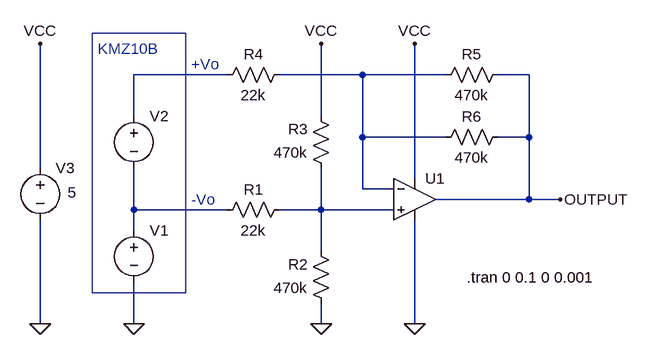
[diagram p0: schematic fieldsensoramp.asc]
fieldsensoramp.asc, the LTspice schematic file:
Version 4
SHEET 1 880 680
WIRE 80 -16 -64 -16
WIRE 288 -16 160 -16
WIRE 416 -16 288 -16
WIRE 544 -16 496 -16
WIRE -64 48 -64 -16
WIRE 224 48 224 -64
WIRE 288 80 288 -16
WIRE 416 80 288 80
WIRE 544 80 544 -16
WIRE 544 80 496 80
WIRE -208 128 -208 -64
WIRE 368 144 368 -64
WIRE 288 160 288 80
WIRE 336 160 288 160
WIRE 544 176 544 80
WIRE 544 176 400 176
WIRE 592 176 544 176
WIRE -64 192 -64 128
WIRE 80 192 -64 192
WIRE 224 192 224 128
WIRE 224 192 160 192
WIRE 336 192 224 192
WIRE -64 224 -64 192
WIRE 224 256 224 192
WIRE -208 368 -208 208
WIRE -64 368 -64 304
WIRE 224 368 224 336
WIRE 368 368 368 208
FLAG -64 368 0
FLAG 224 368 0
FLAG 224 -64 VCC
FLAG 368 368 0
FLAG 368 -64 VCC
FLAG 592 176 OUTPUT
FLAG -208 -64 VCC
FLAG -208 368 0
SYMBOL voltage -64 208 R0
WINDOW 3 42 53 Invisible 0
WINDOW 123 24 72 Left 0
WINDOW 39 0 0 Left 0
SYMATTR InstName V1
SYMATTR Value SINE(2.5 0.5 7)
SYMBOL voltage -64 32 R0
WINDOW 3 37 60 Invisible 0
WINDOW 123 0 0 Left 0
WINDOW 39 0 0 Left 0
SYMATTR InstName V2
SYMATTR Value SINE(0 50m 50)
SYMBOL res 176 176 R90
WINDOW 0 0 56 VBottom 0
WINDOW 3 32 56 VTop 0
SYMATTR InstName R1
SYMATTR Value 22k
SYMBOL res 240 352 R180
WINDOW 0 36 76 Left 0
WINDOW 3 36 40 Left 0
SYMATTR InstName R2
SYMATTR Value 470k
SYMBOL res 240 144 R180
WINDOW 0 36 76 Left 0
WINDOW 3 36 40 Left 0
SYMATTR InstName R3
SYMATTR Value 470k
SYMBOL res 176 -32 R90
WINDOW 0 0 56 VBottom 0
WINDOW 3 32 56 VTop 0
SYMATTR InstName R4
SYMATTR Value 22k
SYMBOL res 512 -32 R90
WINDOW 0 0 56 VBottom 0
WINDOW 3 32 56 VTop 0
SYMATTR InstName R5
SYMATTR Value 470k
SYMBOL Opamps\\UniversalOpamp2 368 176 R0
SYMATTR InstName U1
SYMBOL voltage -208 112 R0
WINDOW 3 42 53 Left 0
WINDOW 123 24 72 Left 0
WINDOW 39 0 0 Left 0
SYMATTR InstName V3
SYMATTR Value 5
SYMBOL res 512 64 R90
WINDOW 0 0 56 VBottom 0
WINDOW 3 32 56 VTop 0
SYMATTR InstName R6
SYMATTR Value 470k
TEXT 448 296 Left 0 !.tran 0 0.1 0 0.001
TEXT -120 -56 Left 0 ;KMZ10B
TEXT 24 -32 Left 0 ;+Vo
TEXT 24 176 Left 0 ;-Vo
RECTANGLE Normal 16 320 -128 -80

The netlist it stands for:
* fieldsensoramp.asc
V1 N003 0 SINE(2.5 0.5 7)
V2 N001 N003 SINE(0 50m 50)
R1 N004 N003 22k
R2 0 N004 470k
R3 N004 VCC 470k
R4 N002 N001 22k
R5 OUTPUT N002 470k
XU1 N004 N002 VCC 0 OUTPUT level.2 Avol=1Meg GBW=10Meg Slew=10Meg ilimit=25m rail=0 Vos=0 phimargin=45 en=0 enk=0 in=0 ink=0 Rin=500Meg  ; pins IN+ IN- V+ V- OUT
V3 VCC 0 5
R6 OUTPUT N002 470k
.tran 0 0.1 0 0.001
* KMZ10B
* +Vo
* -Vo
.lib UniversalOpamps2.sub
.backanno
.end